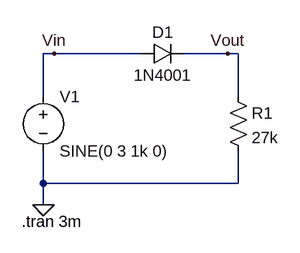
[diagram p0: schematic 311_lab2_p2.asc]
311_lab2_p2.asc, the LTspice schematic file:
Version 4
SHEET 1 880 680
WIRE 32 48 16 48
WIRE 160 48 32 48
WIRE 288 48 224 48
WIRE 304 48 288 48
WIRE 16 112 16 48
WIRE 304 112 304 48
WIRE 16 240 16 192
WIRE 304 240 304 192
WIRE 304 240 16 240
WIRE 16 272 16 240
FLAG 16 272 0
FLAG 32 48 Vin
FLAG 288 48 Vout
SYMBOL voltage 16 96 R0
WINDOW 123 0 0 Left 0
WINDOW 39 0 0 Left 0
SYMATTR InstName V1
SYMATTR Value SINE(0 3 1k 0)
SYMBOL diode 160 64 R270
WINDOW 0 32 32 VTop 2
WINDOW 3 0 32 VBottom 2
SYMATTR InstName D1
SYMATTR Value 1N4001
SYMBOL res 288 96 R0
SYMATTR InstName R1
SYMATTR Value 27k
TEXT -16 296 Left 2 !.tran 3m

The netlist it stands for:
* 311_lab2_p2.asc
V1 Vin 0 SINE(0 3 1k 0)
D1 Vin Vout 1N4001
R1 Vout 0 27k
.model D D
.lib standard.dio
.tran 3m
.backanno
.end